# Altium schematic sheet REUN.468349.001_PSU_Board_Logic.SchDoc
size 420 x 297 mm; DocumentNumber: РЕУН.468349.001 Э3 2D; SheetNumber: 3; Format: A3
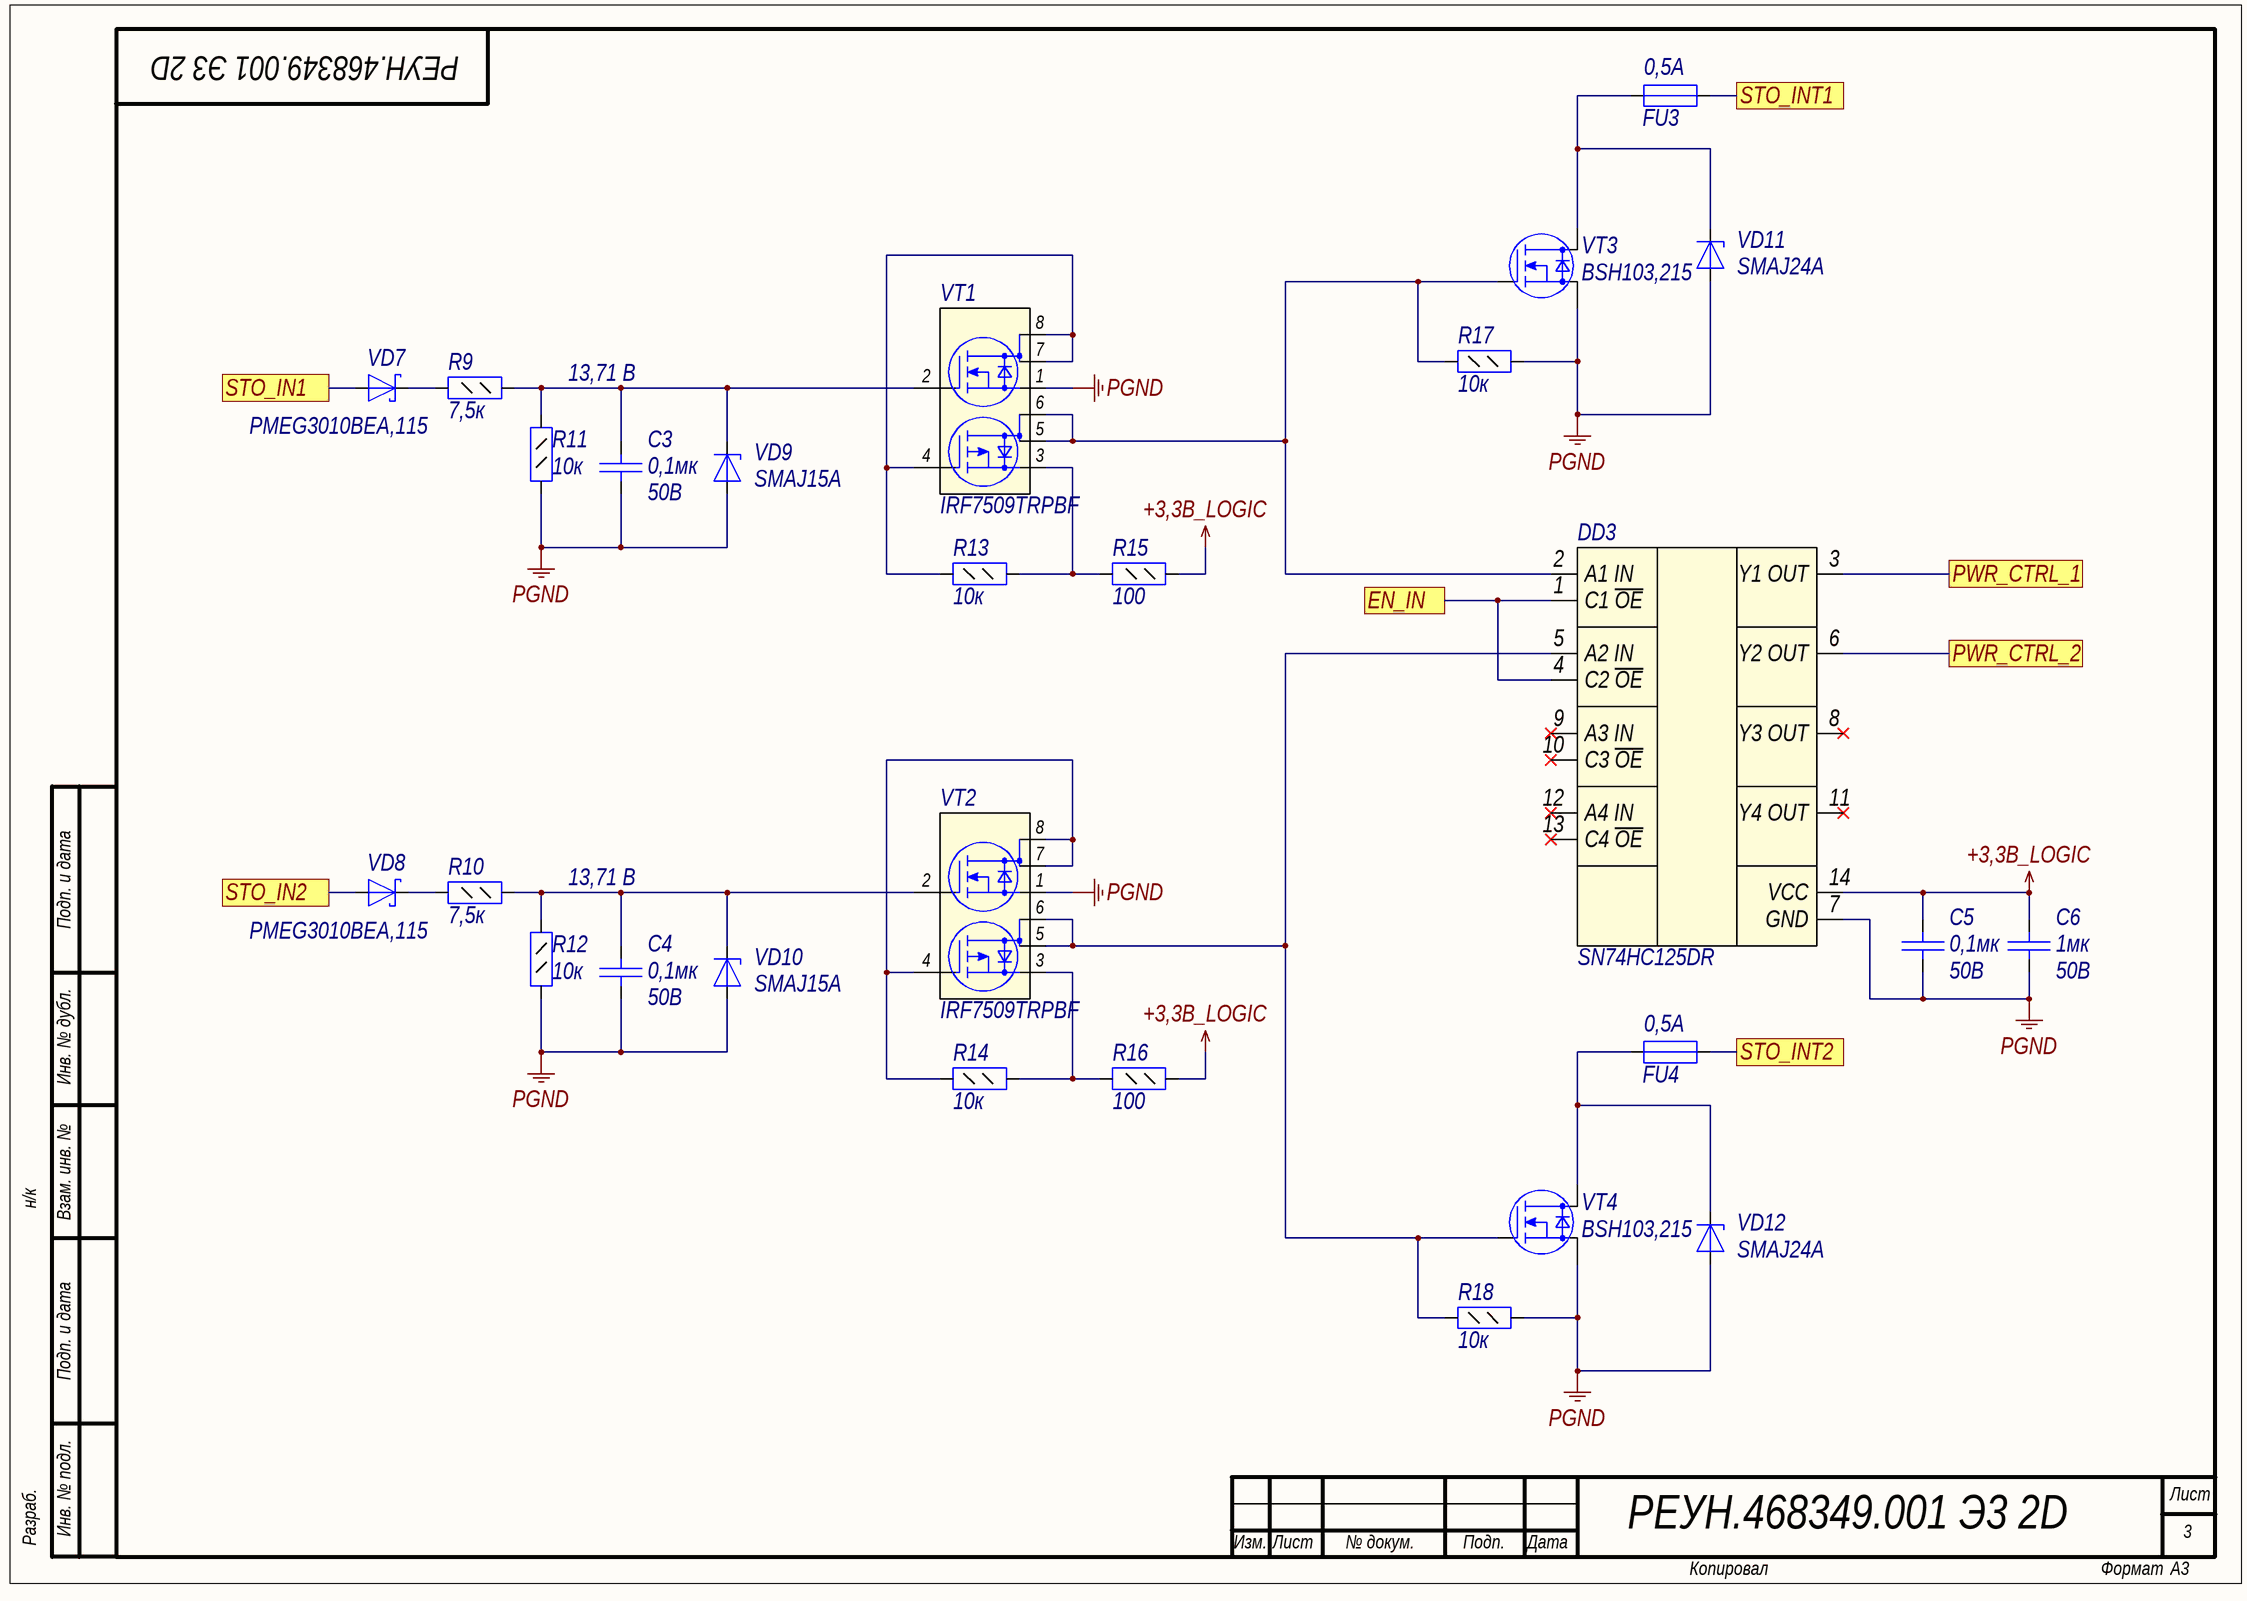
[diagram p0: REUN.468349.001_PSU_Board_Logic.SchDoc]

## Parts
C3  Voltage: 50B  [C0805]  (hidden comment: 0,1мк)
C4  Voltage: 50B  [C0805]  (hidden comment: 0,1мк)
C5  Voltage: 50B  [C0805]  (hidden comment: 0,1мк)
C6  Voltage: 50B  [C0805]  (hidden comment: 1мк)
DD3  SN74HC125DR  [SO14]
FU3  I hold: 0,5A  [FUSE812]  (hidden comment: Fuse)
FU4  I hold: 0,5A  [FUSE812]  (hidden comment: Fuse)
R9  value 7,5к  [R0805]  (hidden comment: Resistor_0,125Вт)
R10  value 7,5к  [R0805]  (hidden comment: Resistor_0,125Вт)
R11  value 10к  [R0805]  (hidden comment: Resistor_0,125Вт)
R12  value 10к  [R0805]  (hidden comment: Resistor_0,125Вт)
R13  value 10к  [R0805]  (hidden comment: Resistor_0,125Вт)
R14  value 10к  [R0805]  (hidden comment: Resistor_0,125Вт)
R15  value 100  [R0805]  (hidden comment: Resistor_0,125Вт)
R16  value 100  [R0805]  (hidden comment: Resistor_0,125Вт)
R17  value 10к  [R0805]  (hidden comment: Resistor_0,125Вт)
R18  value 10к  [R0805]  (hidden comment: Resistor_0,125Вт)
VD7  PMEG3010BEA,115  [SOD-323]
VD8  PMEG3010BEA,115  [SOD-323]
VD9  SMAJ15A  [SMA]
VD10  SMAJ15A  [SMA]
VD11  SMAJ24A  [SMA]
VD12  SMAJ24A  [SMA]
VT1  IRF7509TRPBF  [Micro8]
VT2  IRF7509TRPBF  [Micro8]
VT3  BSH103,215  [SOT23-3]
VT4  BSH103,215  [SOT23-3]

## Ports
EN_IN, PWR_CTRL_1, PWR_CTRL_2, STO_IN1, STO_IN2, STO_INT1, STO_INT2

## Nets
+3,3B_LOGIC: C5.2 C6.2 DD3.14(VCC) R15.1 R16.1
PGND: C3.1 C4.1 C5.1 C6.1 DD3.7(GND) R11.2 R12.2 R17.2 R18.2 VD9.2(A) VD10.2(A) VD11.2(A) VD12.2(A) VT1.1(S1) VT2.1(S1) VT3.2(S) VT4.2(S)
EN_IN: DD3.1(C1_~{OE}) DD3.4(C2_~{OE}) ; port EN_IN
PWR_CTRL_1: DD3.3(Y1_OUT) ; port PWR_CTRL_1
PWR_CTRL_2: DD3.6(Y2_OUT) ; port PWR_CTRL_2
STO_IN1: VD7.2(A) ; port STO_IN1
STO_IN2: VD8.2(A) ; port STO_IN2
STO_INT1: FU3.2 ; port STO_INT1
STO_INT2: FU4.2 ; port STO_INT2
NetC3_2: C3.2 R9.1 R11.1 VD9.1(K) VT1.2(G1)
NetC4_2: C4.2 R10.1 R12.1 VD10.1(K) VT2.2(G1)
NetDD3_2: DD3.2(A1_IN) R17.1 VT1.5(D2) VT1.6(D2) VT3.1(G)
NetDD3_5: DD3.5(A2_IN) R18.1 VT2.5(D2) VT2.6(D2) VT4.1(G)
NetFU3_1: FU3.1 VD11.1(K) VT3.3(D)
NetFU4_1: FU4.1 VD12.1(K) VT4.3(D)
NetR9_2: R9.2 VD7.1(K)
NetR10_2: R10.2 VD8.1(K)
NetR13_1: R13.1 VT1.4(G2) VT1.7(D1) VT1.8(D1)
NetR13_2: R13.2 R15.2 VT1.3(S2)
NetR14_1: R14.1 VT2.4(G2) VT2.7(D1) VT2.8(D1)
NetR14_2: R14.2 R16.2 VT2.3(S2)

Not connected (* = marked no-connect by the designer): DD3 8(Y3_OUT)* 9(A3_IN)* 10(C3_~{OE})* 11(Y4_OUT)* 12(A4_IN)* 13(C4_~{OE})*

## Notes on the sheet
- 13,71 B
- Подп. и дата
- Инв. № дубл.
- н/к
- Взам. инв. №
- Разраб.
- Инв. № подл.
- Лист
- Изм.
- № докум.
- Подп.
- Дата
- Копировал
- Формат

## Library data of the parts
C3-C5 = cap141: Конденсатор; Part Name: Ceramic; Manufacture: Murata; Part Number: GRM21BR71H104KA01K; id: cap141; TKE: X7R; Value: 0,1мк
C6 = cap151: Конденсатор; Part Name: Ceramic; Manufacture: Murata; Part Number: GRM21BR71H105KA12L; id: cap151; TKE: X7R; Value: 1мк
DD3 = logic16: Quad Tri-State Buffer IC; Manufacture: Nexperia; Type of Logic: 3V3 CMOS; Number of elements: 4; Input High Level: 1,75B; Input Low Level: 1,55B; Output High Level: 3,3B; Output Low Level: 0,1B; Toff: 41ns; Power Supply: 2В-6В; id: logic16; Part Name: Quad Tri-State Buffer; Ton: 41ns; Part Number: SN74HC125DR; Temperature: -40...+125
FU3 FU4 = fuse8: Предохранитель; Part Name: Resettable Fuses; Manufacture: Bourns; Part Number: MF-MSMF050; id: fuse8; V max: 15B; I max: 100A; I trip: 1A; Resistance: 0,15Ohms
R9 R10 = res98: Резистор; Manufacture: Yageo; Part Number: RC0805FR-077K5; id: res98; Accuracy: 0.01; Part Name: Resistor; Power: 0,125Вт
R11-R14 R17 R18 = res101: Резистор; Manufacture: Yageo; Part Number: RC0805FR-0710KL; id: res101; Accuracy: 0.01; Part Name: Resistor; Power: 0,125Вт
R15 R16 = res49: Резистор; Manufacture: Yageo; Part Number: RC0805FR-07100RL; id: res49; Accuracy: 0.01; Part Name: Resistor; Power: 0,125Вт
VD7 VD8 = diode63: Диод Шоттки; Part Name: Diode Schottky; Manufacture: NXP Semiconductor; Max Reverse Voltage: 30B; Forward Voltage: 0,13B; Forward Current: 1А; Peak Current: 10A; Reverse Current: 1,5mA; Number: 1; id: diode63; Temp MAX: +150; Temp MIN: -65; Part Number: PMEG3010BEA,115
VD9 VD10 = SMAJ15A: Cтабилитрон (лавинный выпрямительный диод) односторонний; Part Name: TVS diode Unidirectional; Manufacture: ST Microelectronics; id: tvs130; Leakage Current: 0,2uA; Stand-off Voltage: 15B; Breakdown Voltage: 17,6B; Clamping voltage: 24,4B; Dynamic resistance: 0,361Ohm; Peak Pulse Power: 400W; Number of diodes: 1; Part Number: SMAJ15A
VD11 VD12 = SMAJ24A: Cтабилитрон (лавинный выпрямительный диод) односторонний; Part Name: TVS diode Unidirectional; Manufacture: ST Microelectronics; id: tvs134; Leakage Current: 0,2uA; Stand-off Voltage: 24B; Breakdown Voltage: 28,1B; Clamping voltage: 38,9B; Dynamic resistance: 0,912Ohm; Peak Pulse Power: 400W; Number of diodes: 1; Part Number: SMAJ24A
VT1 VT2 = mosfert3: Комплементарная сборка МОП; Manufacturer: International Rectifier; Structure: n-p-channel; V drain-source max: 30B; Rds: 0,11 Ohm; Gate-to-source voltage: (+-)20B; Continuous drain current: 2A; Pulsed drain current: 16A; Power dissipation: 1,25W; id: mosfert3; Part Number: IRF7509TRPBF
VT3 VT4 = mosfert36: N-MOSFET; Manufacturer: Nexperia; Structure: n-channel; V drain-source max: 30B; Rds: 0,5Ohm; Gate-to-source voltage: (+-)8B; Continuous drain current: 0,85A; Total gate charge: 2100pC; Pulsed drain current: 3,4A; Power dissipation: 0,5W; id: mosfert36; Part Number: BSH103,215